# Altium schematic sheet UPCNSL-ABS-AX5043adaptor.SchDoc
size A
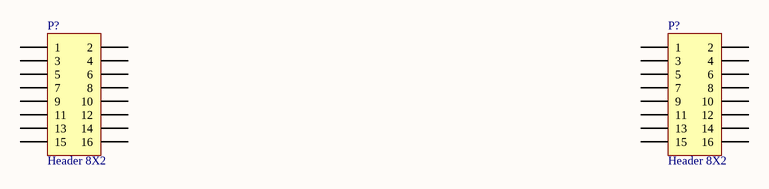
[diagram p0: UPCNSL-ABS-AX5043adaptor.SchDoc]

## Parts
(Parts that share a designator on the sheet are numbered #1, #2 ... from top to bottom, then left to right.)
P?#1  Header 8X2  [HDR2X8]
P?#2  Header 8X2  [HDR2X8]

## Nets

Not connected (* = marked no-connect by the designer): P?#1 1 2 3 4 5 6 7 8 9 10 11 12 13 14 15 16; P?#2 1 2 3 4 5 6 7 8 9 10 11 12 13 14 15 16

## Library data of the parts
P?#1 P?#2 = Header 8X2: Header, 8-Pin, Dual row; LatestRevisionDate: 17-Jul-2002; LatestRevisionNote: Re-released for DXP Platform.; Publisher: Altium Limited